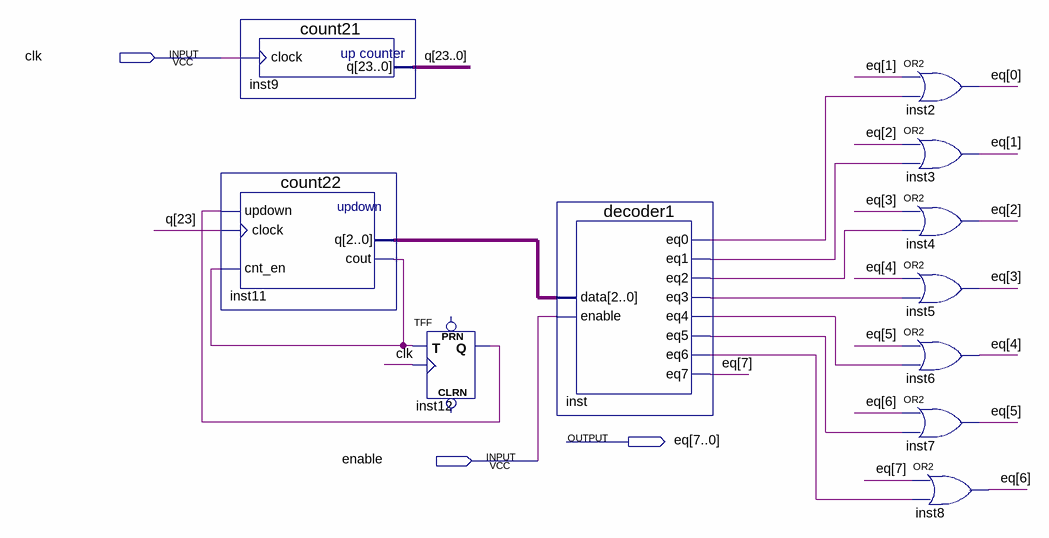
[diagram p0: schematic sheet]
// Quartus schematic b21.bdf as structural Verilog: 11 symbols, 3 pins
module b21 (
  input  clk,
  input  enable,
  output [7:0] eq
);

  wire inst11_cout, inst12_q, inst_eq0, inst_eq1, inst_eq2, inst_eq3, inst_eq4, inst_eq5, inst_eq6;
  wire [2:0] inst11_q;
  wire [23:0] q;

  count22 inst11 (.updown(inst12_q), .clock(q[23]), .cnt_en(inst11_cout), .cout(inst11_cout), .q(inst11_q));
  count21 inst9 (.clock(clk), .q(q));
  TFF inst12 (.T(inst11_cout), .CLK(clk), .Q(inst12_q));  // open: PRN, CLRN
  decoder1 inst (
    .data(inst11_q), .enable(enable), .eq0(inst_eq0), .eq1(inst_eq1), .eq2(inst_eq2), .eq3(inst_eq3),
    .eq4(inst_eq4), .eq5(inst_eq5), .eq6(inst_eq6), .eq7(eq[7]));
  or inst2 (eq[0], eq[1], inst_eq0);
  or inst3 (eq[1], eq[2], inst_eq1);
  or inst4 (eq[2], eq[3], inst_eq2);
  or inst5 (eq[3], eq[4], inst_eq3);
  or inst6 (eq[4], eq[5], inst_eq4);
  or inst7 (eq[5], eq[6], inst_eq5);
  or inst8 (eq[6], eq[7], inst_eq6);
endmodule
